# Altium schematic sheet FarBreakout.SchDoc
size A4; SheetNumber: 1; SheetTotal: 1
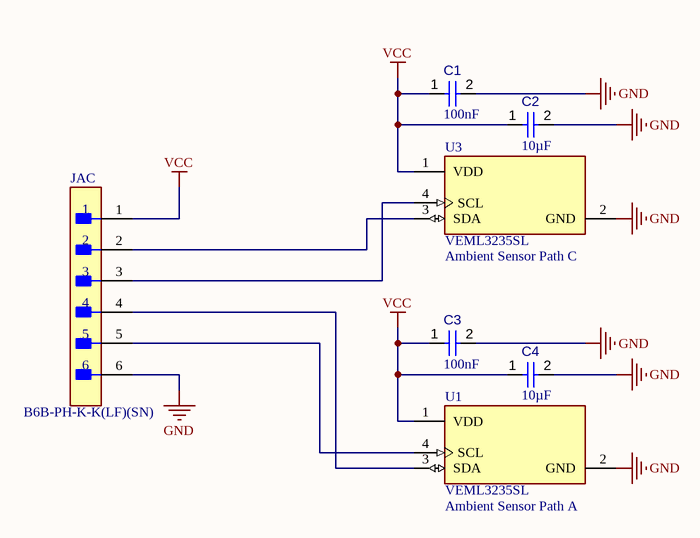
[diagram p0: FarBreakout.SchDoc]

## Parts
C1  value 100nF  [FP-0805-L_2_01_0_2-W_1_25-IPC_B]  (hidden comment: 08051C104K4T2A)
C2  value 10µF  [CAPC0805(2012)145_L]  (hidden comment: Capacitor 10µF +/-20% 25V 0805)
C3  value 100nF  [FP-0805-L_2_01_0_2-W_1_25-IPC_B]  (hidden comment: 08051C104K4T2A)
C4  value 10µF  [CAPC0805(2012)145_L]  (hidden comment: Capacitor 10µF +/-20% 25V 0805)
JAC  B6B-PH-K-K(LF)(SN)  [FP-B6B-PH-K-K_LF_SN-MFG]
U1  VEML3235SL  [FP-VEML3235SL-MFG]
U3  VEML3235SL  [FP-VEML3235SL-MFG]

## Nets
GND: C1.2 C2.2 C3.2 C4.2 JAC.6 U1.2(GND) U3.2(GND)
VCC: C1.1 C2.1 C3.1 C4.1 JAC.1 U1.1(VDD) U3.1(VDD)
NetJAC_2: JAC.2 U3.3(SDA)
NetJAC_3: JAC.3 U3.4(SCL)
NetJAC_4: JAC.4 U1.3(SDA)
NetJAC_5: JAC.5 U1.4(SCL)

## Notes on the sheet
- (near U3) Ambient Sensor Path C
- (near U1) Ambient Sensor Path A

## Library data of the parts
C1 C3 = CMP-001-00084-1: Ceramic Capacitor, Multilayer, Ceramic, 100V, 10% +Tol, 10% -Tol, X7R, 15% TC, 0.1uF, Surface Mount, 0805; Max Operating Temperature: 125°C; Mounting Technology: Surface Mount; RoHS Compliant: Yes; Capacitor Type: Ceramic; Pins: 2; Case/Package: 0805; Min Operating Temperature: -55°C
C2 C4 = CMP-001-00079-4: Chip Capacitor, 10µF +/-20%, 25V, 0805, Thickness 1.45 mm; Tolerance: 10%; Max Operating Temperature: 85°C; Case/Package: 0805; Voltage Rating: 25V; Min Operating Temperature: -55°C; Mounting Technology: SMT; Pins: 2
JAC = CMP-002-00087-1: PH Series 6 Position 2 mm Pitch Through Hole Top Entry Shrouded Header
U1 U3 = CMP-02530-000008-1: AMBIENT LIGHT SENSOR, IC, SIDE L